# Altium schematic sheet Labrapport 1.SchDoc: TTT4280 Skjematikk
size A4; DocumentNumber: 1; SheetNumber: 1; SheetTotal: 2; DocumentTitle: TTT4280 PCB; ProjectEngineer: Håkon Liverud
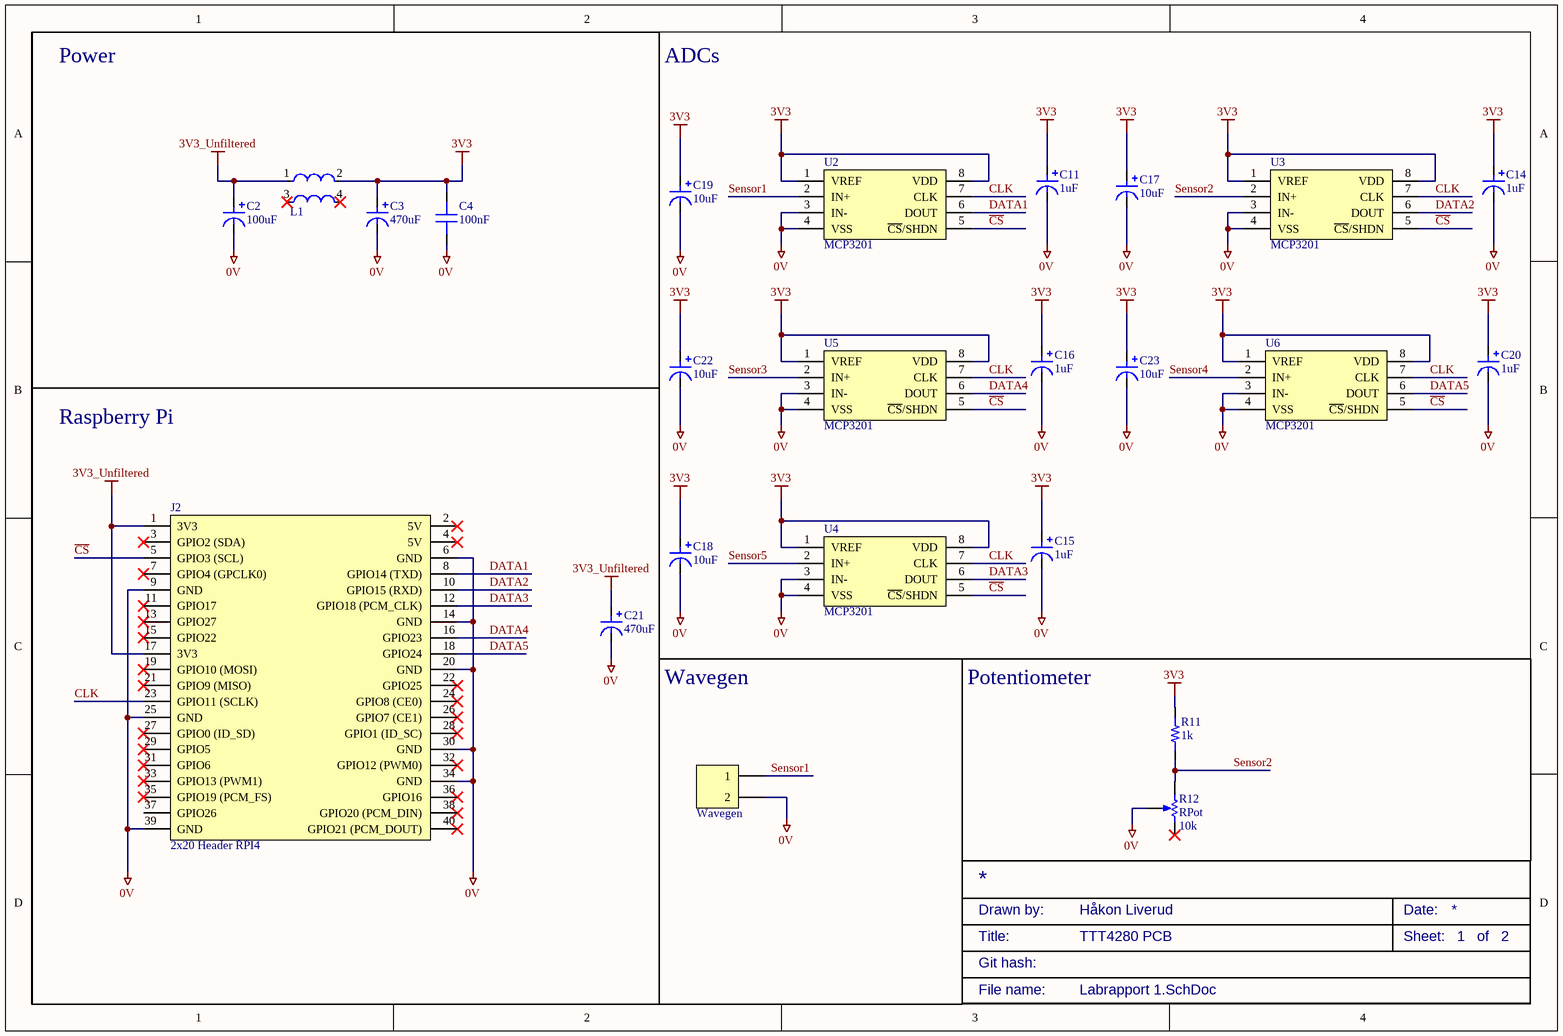
[diagram p0: Labrapport 1.SchDoc]

## Parts
C2  100uF  [CTHT 5MM]
C3  470uF  [CTHT 8mm]
C4  100nF  [C TDK Film 7.3x2.5x6.5mm]
C11  1uF  [CTHT 4MM]
C14  1uF  [CTHT 4MM]
C15  1uF  [CTHT 4MM]
C16  1uF  [CTHT 4MM]
C17  10uF  [CTHT 4MM]
C18  10uF  [CTHT 4MM]
C19  10uF  [CTHT 4MM]
C20  1uF  [CTHT 4MM]
C21  470uF  [CTHT 8mm]
C22  10uF  [CTHT 4MM]
C23  10uF  [CTHT 4MM]
J2  2x20 Header RPI4  [HDRV40W87P254_2X20_5093X508X1067P]
L1  100mH Inductor  [DKFP-G22G-D5J0]  (value not drawn)
P1  Wavegen  [HDR1X2]
R11  1k  [R0603]
R12  RPot  value 10k  [VR5]
U2  MCP3201  [DIP781W56P254L950H533Q8N]
U3  MCP3201  [DIP781W56P254L950H533Q8N]
U4  MCP3201  [DIP781W56P254L950H533Q8N]
U5  MCP3201  [DIP781W56P254L950H533Q8N]
U6  MCP3201  [DIP781W56P254L950H533Q8N]

## Blocks framed on the sheet
Power: C2-C4 L1
Raspberry Pi: C21 J2
Wavegen: P1
Potentiometer: R11 R12

## Nets
0V: C2.2 C3.2 C4.1 C11.2 C14.2 C15.2 C16.2 C17.2 C18.2 C19.2 C20.2 C21.2 C22.2 C23.2 J2.6(GND) J2.9(GND) J2.14(GND) J2.20(GND) J2.25(GND) J2.30(GND) J2.34(GND) J2.39(GND) P1.2 R12.3(TAP) U2.3(IN-) U2.4(VSS) U3.3(IN-) U3.4(VSS) U4.3(IN-) U4.4(VSS) U5.3(IN-) U5.4(VSS) U6.3(IN-) U6.4(VSS)
3V3: C3.1 C4.2 C11.1 C14.1 C15.1 C16.1 C17.1 C18.1 C19.1 C20.1 C22.1 C23.1 L1.2 R11.2 U2.1(VREF) U2.8(VDD) U3.1(VREF) U3.8(VDD) U4.1(VREF) U4.8(VDD) U5.1(VREF) U5.8(VDD) U6.1(VREF) U6.8(VDD)
3V3_Unfiltered: C2.1 C21.1 J2.1(3V3) J2.17(3V3) L1.1
~{CS}: J2.5(GPIO3_(SCL)) U2.5(~{CS}/SHDN) U3.5(~{CS}/SHDN) U4.5(~{CS}/SHDN) U5.5(~{CS}/SHDN) U6.5(~{CS}/SHDN)
CLK: J2.23(GPIO11_(SCLK)) U2.7(CLK) U3.7(CLK) U4.7(CLK) U5.7(CLK) U6.7(CLK)
DATA1: J2.8(GPIO14_(TXD)) U2.6(DOUT)
DATA2: J2.10(GPIO15_(RXD)) U3.6(DOUT)
DATA3: J2.12(GPIO18_(PCM_CLK)) U4.6(DOUT)
DATA4: J2.16(GPIO23) U5.6(DOUT)
DATA5: J2.18(GPIO24) U6.6(DOUT)
Sensor1: P1.1 U2.2(IN+)
Sensor2: R11.1 R12.1(TOP) U3.2(IN+)
Sensor3: U5.2(IN+)
Sensor4: U6.2(IN+)
Sensor5: U4.2(IN+)

Not connected (* = marked no-connect by the designer): J2 2(5V)* 3(GPIO2_(SDA))* 4(5V)* 7(GPIO4_(GPCLK0))* 11(GPIO17)* 13(GPIO27)* 15(GPIO22)* 19(GPIO10_(MOSI))* 21(GPIO9_(MISO))* 22(GPIO25)* 24(GPIO8_(CE0))* 26(GPIO7_(CE1))* 27(GPIO0_(ID_SD))* 28(GPIO1_(ID_SC))* 29(GPIO5)* 31(GPIO6)* 32(GPIO12_(PWM0))* 33(GPIO13_(PWM1))* 35(GPIO19_(PCM_FS))* 36(GPIO16)* 37(GPIO26) 38(GPIO20_(PCM_DIN))* 40(GPIO21_(PCM_DOUT))*; L1 3* 4*; R12 2(BOT)*

## Notes on the sheet
- ADCs
- Drawn by:
- Date:
- Git hash:
- Title:
- File name:

## Library data of the parts
C2 = 100uF 5mm THT: 100uF 5mm THT Cap
C3 = 470uF 8mm THT: 0.8pF 8mm THT Cap
C4 = 100nF Film: 100nF Film Cap; Value: 0.1uF
C11 C14-C16 C20 = 1uF 4mm THT: 1uF 4mm THT Cap
C17-C19 C22 C23 = 10uF 4mm THT: 10uF 4mm THT Cap
C21 = 470uF 8mm THT: 100uF 8mm THT Cap
J2 = 2222_1: GPIO MALE HEADER RASPBERRY PI
L1 = DKFP-G22G-D5J0: Common Mode Chokes / Filters DKFP COMP.CHOKE THT P O 0.5A 2X100mH
P1 = Header 2: Header, 2-Pin; LatestRevisionDate: 17-Jul-2002; LatestRevisionNote: Re-released for DXP Platform.; Publisher: Altium Limited
R11 = 10k 0603: 10k 0603 Res; Value: 1K
R12 = RPot: Potentiometer; Sim Note: Enter the Resistance value and the set point into parameter fields.; Set Position: 0.5; Published: 8-Jun-2000; LatestRevisionDate: 17-Jul-2002; LatestRevisionNote: Re-released for DXP Platform.; PackageReference: VR5; Publisher: Altium Limited; PackageDescription: Variable Resistor, Thru-Hole; 3 Leads
U2-U6 = MCP3201-BI_P: 12-Bit, 100kSPS, Single Channel ADC; Manufacturer_Name: Microchip; Manufacturer_Part_Number: MCP3201-BI/P; Datasheet Link: http://uk.rs-online.com/web/p/products/1654833; Height: 5.334mm; Mouser Part Number: 579-MCP3201-BI/P; Mouser Price/Stock: https://www.mouser.co.uk/ProductDetail/Microchip-Technology-Atmel/MCP3201-BI-P?qs=Vn0zuzr35GGoo291EIbsHA%3D%3D; Arrow Part Number: MCP3201-BI/P; Arrow Price/Stock: https://www.arrow.com/en/products/mcp3201-bip/microchip-technology?region=nac